# EAGLE design damp (EAGLE 7.1.0)
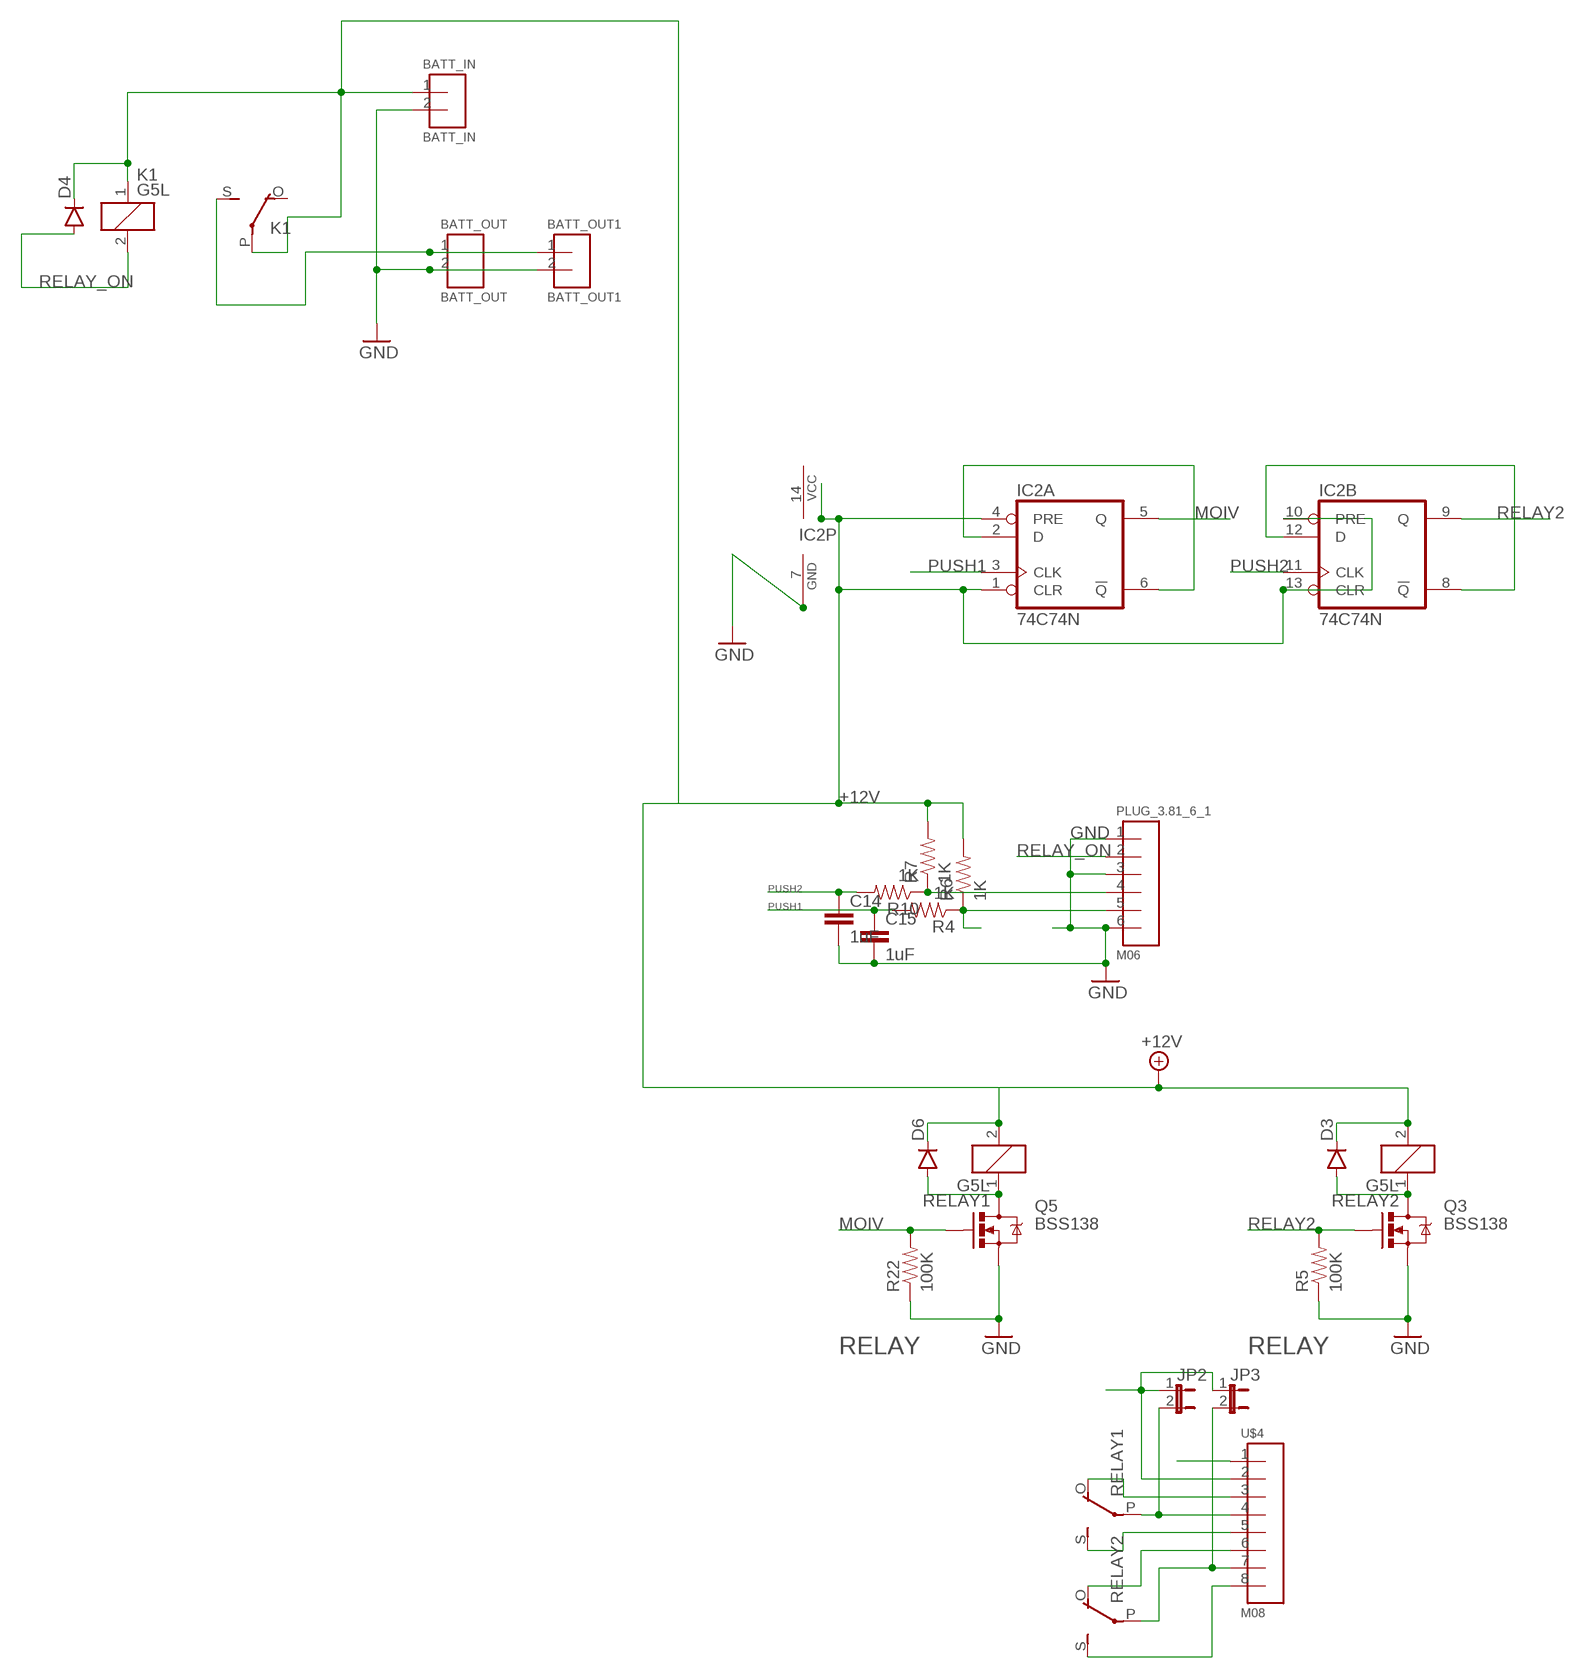
[diagram p0: schematic, sheet 1]

## Parts
BATT_IN  BATT_IN  M02PLUG  [PLUG_02]
BATT_OUT  BATT_OUT  M02PLUG  [PLUG_02]
BATT_OUT1  BATT_OUT1  M02PLUG  [PLUG_02]
C14  1uF  C-EUC0603  [C0603]
C15  1uF  C-EUC0603  [C0603]
D3  DIODESMA-ALT  [SMA-DIODE_ALT]
D4  DIODESMA-ALT  [SMA-DIODE_ALT]
D6  DIODESMA-ALT  [SMA-DIODE_ALT]
IC2  74C74N  74LS74N  [DIL14]
JP2  JP1E  [JP1]
JP3  JP1E  [JP1]
K1  G5L  [G5LE]
PLUG_3.81_6_1  M06  [PLUG_06]
Q3  BSS138  MOSFET-NCHANNELBSS138  [SOT23-3]
Q5  BSS138  MOSFET-NCHANNELBSS138  [SOT23-3]
R4  1K  RESISTOR0603-RES  [0603-RES]
R5  100K  RESISTOR0603-RES  [0603-RES]
R6  1K  RESISTOR0603-RES  [0603-RES]
R7  1K  RESISTOR0603-RES  [0603-RES]
R10  1K  RESISTOR0603-RES  [0603-RES]
R22  100K  RESISTOR0603-RES  [0603-RES]
RELAY1  G5L  [G5LE]
RELAY2  G5L  [G5LE]
U$4  M08  [PLUG_08]

## Nets
+12V [5V]: BATT_IN.1 D3.C D4.C D6.C IC2.1(A:CLR) IC2.4(A:PRE) IC2.10(B:PRE) IC2.13(B:CLR) K1.1 K1.P(2:P) R6.2 R7.2 RELAY1.2 RELAY2.2
AUDIO_OUT1: JP2.1 JP3.1 U$4.2
AUDIO_OUT2: U$4.1
GND: BATT_IN.2 BATT_OUT1.2 BATT_OUT.2 C14.2 C15.2 PLUG_3.81_6_1.1 PLUG_3.81_6_1.3 PLUG_3.81_6_1.6 Q3.2(S) Q5.2(S) R5.1 R22.1
MOIV: IC2.5(A:Q) Q5.1(G) R22.2
N$3: JP2.2 RELAY1.P(2:P) U$4.4
N$12: RELAY1.O(2:O) U$4.3
N$15: RELAY1.S(2:S) U$4.5
N$16: RELAY2.O(2:O) U$4.6
N$17: RELAY2.S(2:S) U$4.8
N$19: D6.A Q5.3(D) RELAY1.1
N$20: PLUG_3.81_6_1.4 R7.1 R10.1
N$21: JP3.2 RELAY2.P(2:P) U$4.7
N$22: PLUG_3.81_6_1.5 R4.1 R6.1
N$26: D3.A Q3.3(D) RELAY2.1
N$29: IC2.2(A:D) IC2.6(A:!Q)
N$32: IC2.8(B:!Q) IC2.12(B:D)
N$37 [5V]: BATT_OUT1.1 BATT_OUT.1 K1.S(2:S)
PUSH1: C15.1 IC2.3(A:CLK) R4.2
PUSH2: C14.1 IC2.11(B:CLK) R10.2
RELAY2: IC2.9(B:Q) Q3.1(G) R5.2
RELAY_ON: D4.A K1.2 PLUG_3.81_6_1.2
Unconnected: K1.O(2:O)

## Notes on the sheet
- RELAY | RELAY

## Power pins joined to a net without a drawn wire
GND: IC2.7(P:GND)
VCC: IC2.14(P:VCC)

## Library data of the parts
BATT_IN BATT_OUT BATT_OUT1 = pierre_vv:M02
C14 C15 = rcl:C-EU: CAPACITOR, European symbol
D3 D4 D6 = SparkFun-DiscreteSemi:DIODE: Diode These are standard reverse protection diodes and small signal diodes. SMA package can handle up to about 1A. SOD-323 can handle about 200mA. What the SOD-323 package when ordering, there are some mfgs out there that are 5-pin packages.
IC2 = 74xx-us:74*74: Dual D type positive edge triggered FLIP FLOP, preset and clear
JP2 JP3 = jumper:JP1E: JUMPER
K1 RELAY1 RELAY2 = relay:G5L: RELAY 1 x switch, 10 A/120 V AC, 8 A/30 V ADC, Omron; OC_FARNELL: unknown; OC_NEWARK: unknown
PLUG_3.81_6_1 = pierre_vv:M06
Q3 Q5 = SparkFun-DiscreteSemi:MOSFET-NCHANNEL: Common NMOSFET Parts MFG P/N Store ID Prod ID FDD8780 TRANS-09984 SI7820DN TRANS-11055 FDS6630A IC-08089 2N7002PW TRANS-11151 FQP30N06L COM-10213 TRANS-10060 BSS123LT1G TRANS-08345 BSS138 TRANS-00830 BS170 2N7000; PROD_ID: TRANS-00830
R4-R7 R10 R22 = SparkFun-Passives:RESISTOR: Resistor Basic schematic elements and footprints for 0603, 1206, and PTH resistors.
U$4 = pierre_vv:M08

## Net classes
0 default: width 0.203 mm
1 GND: width 0.254 mm
3 5V: width 0.305 mm
4 230AC: width 0.61 mm, clearance 0.305 mm

## Board
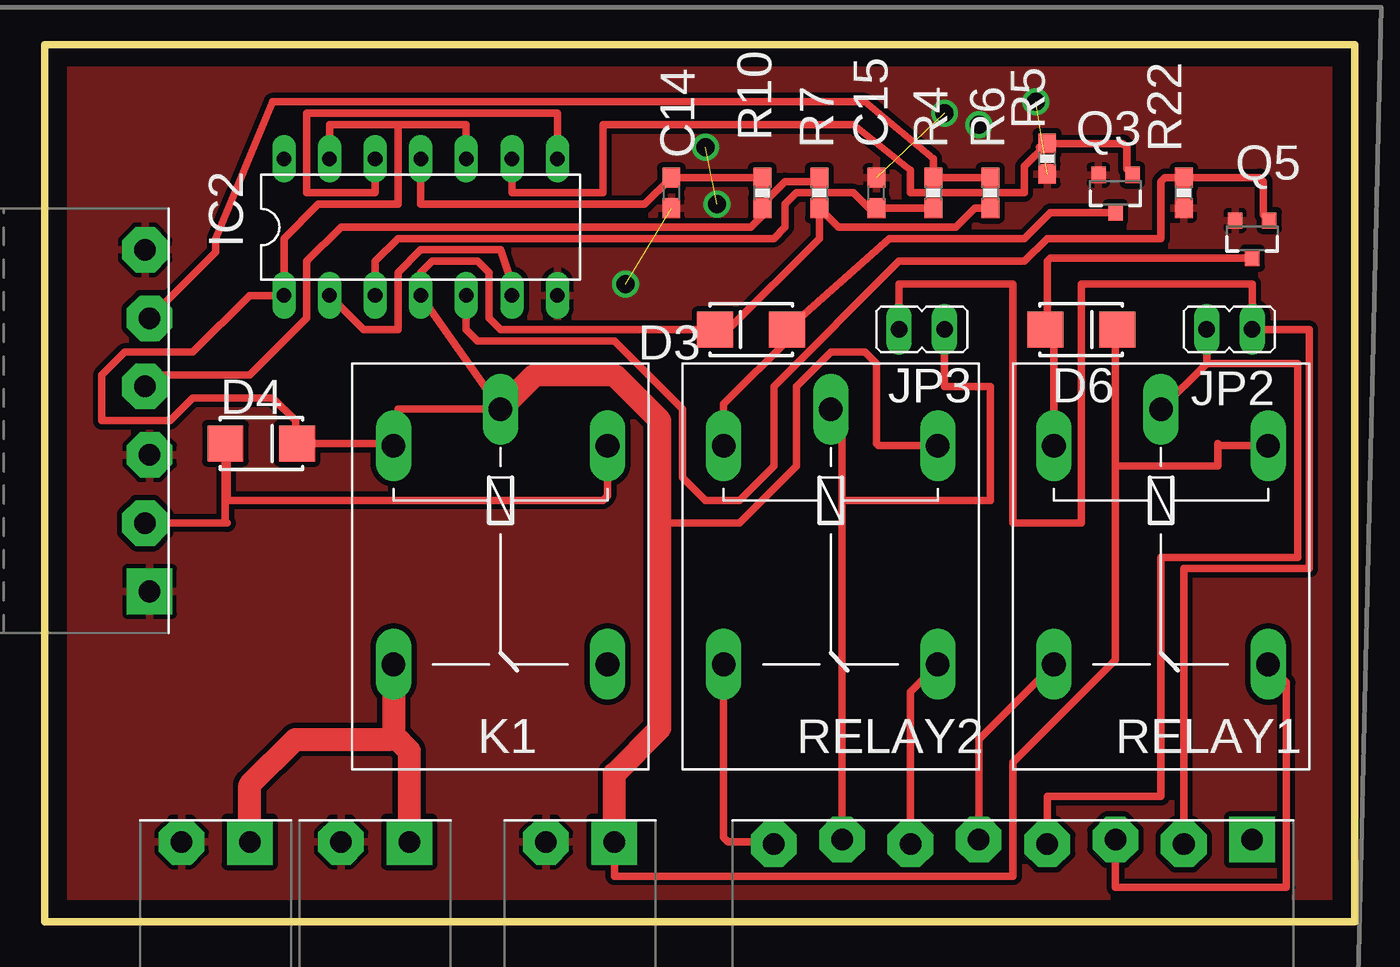
[diagram p1: board, top side]
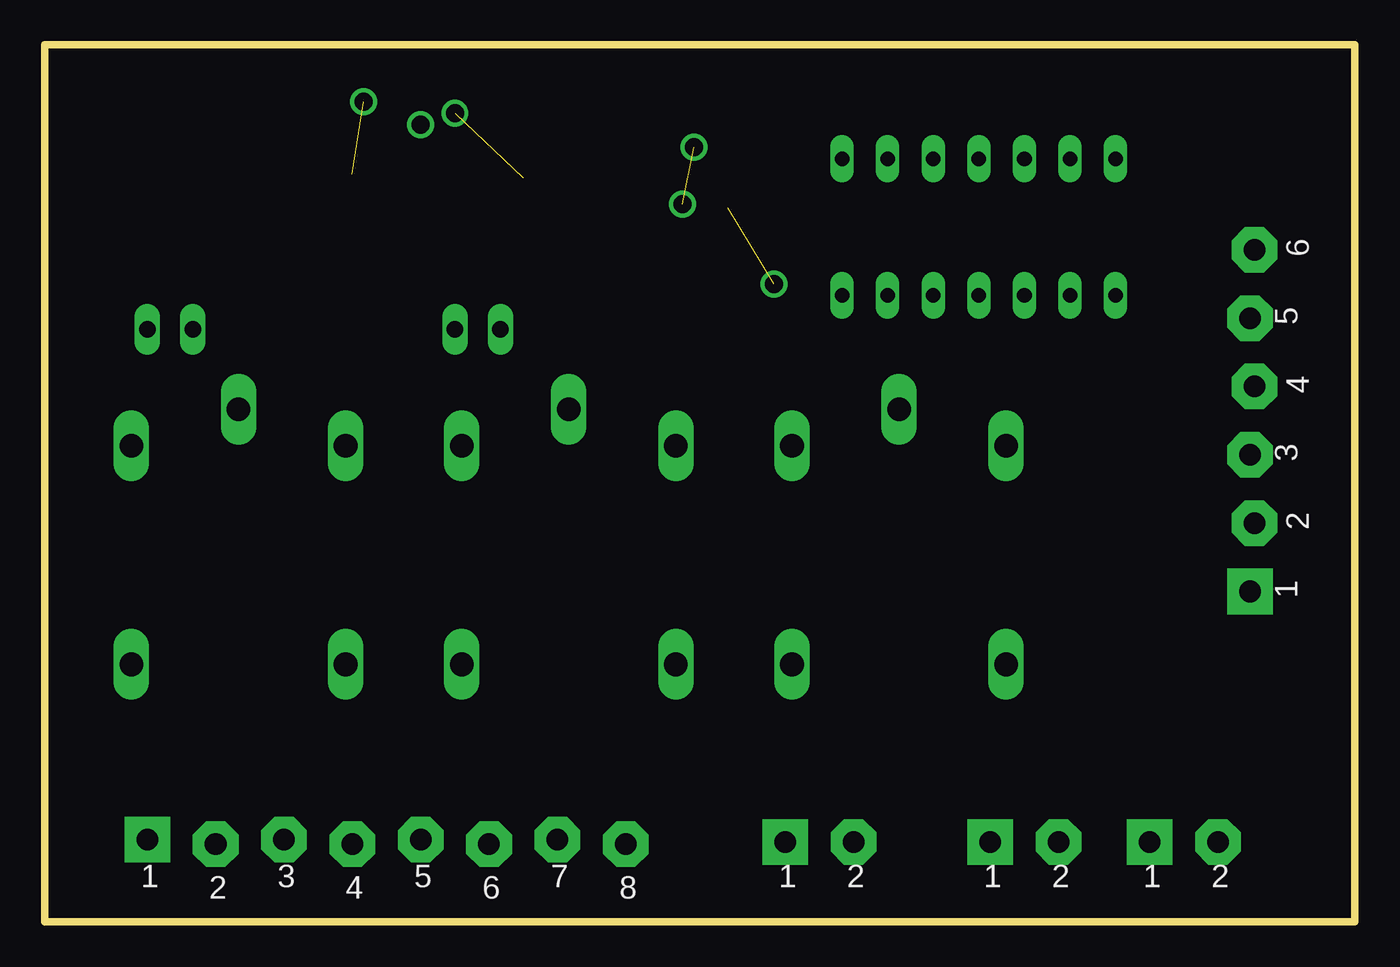
[diagram p2: board, bottom side, seen from below]

Size 73.03 x 48.9 mm. Coordinates in mm from the lower left corner, seen from the top.
Outline: 0,0 73.03,0 73.03,48.9 0,48.9 0,0
Copper layers (1*16): Top 0.035mm / dielectric 1.5mm / Bottom 0.035mm
Design rules "default": minimum track width 10mil, minimum drill 24mil, track to track 8mil, track to pad 8mil, pad to pad 8mil, via to via 8mil, smd to smd 8mil, copper to edge 40mil, drill to drill 8mil, minimum pad ring 10mil, minimum via ring 8mil, stop-mask expansion 4mil, vias tented up to drill 0mil, thermal gap 10mil

### Footprints (pad centres in the part's own frame; a part is rotated, then mirrored left to right if it is on the bottom)
PLUG_02 = drill 1.2 pad 2.54 square: 1 -1.905,0 | drill 1.2 pad 2.54 octagon: 2 1.905,0
C0603 = smd 1.1 x 1: 1 -0.85,0; 2 0.85,0
SMA-DIODE_ALT = smd 2 x 2: A -2,0; C 2,0
DIL14 = drill 0.813 long: 1 -7.62,-3.81; 2 -5.08,-3.81; 3 -2.54,-3.81; 4 0,-3.81; 5 2.54,-3.81; 6 5.08,-3.81; 7 7.62,-3.81; 8 7.62,3.81; 9 5.08,3.81; 10 2.54,3.81; 11 0,3.81; 12 -2.54,3.81; 13 -5.08,3.81; 14 -7.62,3.81
JP1 = drill 0.914 long: 1 0,-1.27; 2 0,1.27
G5LE = drill 1.321 long: 1 -7.493,-5.969; 2 -7.493,5.969; O 4.699,5.969; P -9.525,0; S 4.699,-5.969
PLUG_06 = drill 1.2 pad 2.54 square: 1 -9.525,-0.127 | drill 1.2 pad 2.54 octagon: 2 -5.715,0.127; 3 -1.905,-0.127; 4 1.905,0.127; 5 5.715,-0.127; 6 9.525,0.127
SOT23-3 = smd 0.8 x 0.9: 1 -0.95,-1; 2 0.95,-1; 3 0,1.1
0603-RES = smd 1.1 x 1: 1 -0.85,0; 2 0.85,0
PLUG_08 = drill 1.2 pad 2.54 square: 1 -13.335,-0.127 | drill 1.2 pad 2.54 octagon: 2 -9.525,0.127; 3 -5.715,-0.127; 4 -1.905,0.127; 5 1.905,-0.127; 6 5.715,0.127; 7 9.525,-0.127; 8 13.335,0.127

### Placement (x,y rotation side)
BATT_IN  29.84,4.45 180 top
BATT_OUT  9.53,4.45 180 top
BATT_OUT1  18.41,4.45 180 top
C14  34.92,40.64 270 top
C15  46.35,40.64 90 top
D3  39.37,33.02 180 top
D4  12.06,26.67 0 top
D6  57.78,33.02 0 top
IC2  20.95,38.73 0 top
JP2  66.04,33.02 90 top
JP3  48.9,33.02 270 top
K1  25.4,19.05 270 top
PLUG_3.81_6_1  5.71,27.94 90 top
Q3  59.69,40.64 180 top
Q5  67.31,38.1 180 top
R4  49.53,40.64 270 top
R5  55.88,42.55 90 top
R6  52.7,40.64 270 top
R7  43.18,40.64 270 top
R10  40.01,40.64 90 top
R22  63.5,40.64 90 top
RELAY1  62.23,19.05 270 top
RELAY2  43.81,19.05 270 top
U$4  53.98,4.45 180 top

### Tracks (layer width: path | path; a pad name or v marks a point on that pad's centre or on a via)
+12V
  Top 0.406: IC2.13 15.88,44.45 19.68,44.45 | 19.68,44.45 23.5,44.45 IC2.10 | 19.68,44.45 19.68,40.01 15.24,40.01 13.34,38.1 IC2.1 11.43,34.92 8.26,31.75 4.45,31.75 3.17,30.48 3.17,27.94 6.99,27.94 8.26,29.21 12.7,29.21 13.97,27.94 13.97,26.77 D4.C 19.3,26.67 K1.1 19.68,26.8 19.68,28.57 K1.P IC2.4 20.95,36.2 21.59,36.83 24.13,36.83 24.77,36.2 24.77,33.66 25.4,33.02 D3.C 38.1,33.02 43.18,38.1 R7.2 44.23,38.73 50.8,38.73 51.85,39.79 R6.2 | RELAY1.2 65.53,26.54 65.41,26.67 65.41,25.4 59.69,25.4 | 59.69,25.4 59.69,32.38 | 59.69,32.38 59.69,32.92 D6.C 59.78,32.48 59.69,32.38 | RELAY2.2 46.48,26.54 46.35,26.67 46.35,31.11 45.72,31.75 43.81,31.75 41.91,29.84 41.91,25.4 38.73,22.23 34.29,22.23 | 59.69,25.4 59.69,14.61 53.98,8.89 53.98,2.54 31.75,2.54 BATT_IN.1
  Top 1.27: BATT_IN.1 31.75,8.26 34.29,10.79 34.29,22.23 34.29,27.94 31.75,30.48 27.3,30.48 K1.P
AUDIO_OUT1
  Top 0.406: U$4.2 63.5,19.68 70.48,19.68 70.48,33.02 JP2.1 67.31,35.56 57.78,35.56 57.78,22.23 53.98,22.23 53.98,35.56 47.62,35.56 JP3.1
GND  (via drill 1)  (4 unrouted)
  other vias: 37.47,40.01 32.38,35.56 36.83,43.18 50.16,45.09 52.07,44.45 55.24,45.72 55.24,45.72
  pour Top (isolate 0.305): -1.91,53.34 76.2,53.34 77.47,-0.64 -0.64,-0.64
MOIV
  Top 0.406: Q5.1 67.94,39.41 67.94,41.27 67.73,41.49 R22.2 62.45,41.49 62.23,41.27 62.23,38.1 55.88,38.1 54.61,36.83 47.62,36.83 40.64,29.84 40.64,25.4 38.73,23.5 36.83,23.5 35.56,24.77 35.56,28.57 31.75,32.38 24.13,32.38 23.5,33.02 IC2.5
N$3
  Top 0.406: U$4.4 55.88,6.99 62.23,6.99 62.23,20.32 69.85,20.32 69.85,31.11 64.77,31.11 | 64.77,31.11 JP2.2 | 64.77,31.11 RELAY1.P
N$12
  Top 0.406: U$4.3 59.69,1.91 69.22,1.91 69.22,13.34 RELAY1.O
N$15
  Top 0.406: U$4.5 52.07,10.16 RELAY1.S
N$16
  Top 0.406: U$4.6 48.26,12.83 RELAY2.O
N$17
  Top 0.406: RELAY2.S 37.85,4.7 38.1,4.45 40.51,4.45 U$4.8
N$19
  Top 0.406: RELAY1.1 56.26,32.54 D6.A 55.88,33.12 55.88,36.83 56.05,37 Q5.3
N$20
  Top 0.406: R7.1 42.97,41.27 41.27,41.27 40.01,40.01 R10.1 40.01,39.37 39.37,38.73 16.51,38.73 14.61,36.83 14.61,33.66 11.43,30.48 6.22,30.48 PLUG_3.81_6_1.4
N$21
  Top 0.406: U$4.7 44.45,23.5 | 44.45,23.5 44.45,27.94 RELAY2.P | JP3.2 50.16,29.84 52.7,29.84 52.7,23.5 44.45,23.5
N$22
  Top 0.406: R6.1 R4.1 49.53,42.55 45.72,45.72 12.7,45.72 9.53,38.1 9.53,37.34 PLUG_3.81_6_1.5
N$26
  Top 0.406: RELAY2.1 37.85,28.86 41.64,32.66 D3.A 47.09,38.1 54.61,38.1 56.05,39.54 Q3.3
N$29
  Top 0.406: IC2.2 17.78,33.02 19.68,33.02 19.68,36.2 20.95,37.47 25.4,37.47 26.04,35.56 IC2.6
N$32
  Top 0.406: IC2.8 28.57,45.09 14.61,45.09 14.61,40.64 18.41,40.64 IC2.12
N$37
  Top 1.27: K1.S 19.43,10.41 | 19.43,10.41 20.32,9.53 BATT_OUT1.1 | BATT_OUT.1 11.43,7.62 13.97,10.16 19.18,10.16 19.43,10.41
PUSH1
  Top 0.406: R4.2 C15.1 45.94,39.79 45.09,40.64 41.91,40.64 41.27,40.01 41.27,38.73 40.64,38.1 19.68,38.1 18.41,36.83 IC2.3
PUSH2
  Top 0.406: IC2.11 20.95,40.01 33.44,40.01 C14.1 R10.2
RELAY2
  Top 0.406: IC2.9 26.04,40.64 31.11,40.64 31.11,44.45 45.09,44.45 48.26,41.91 48.26,40.64 54.61,40.64 54.61,42.12 R5.2 | 55.46,43.18 R5.2 | R5.2 60.11,43.4 60.33,43.18 60.33,41.95 Q3.1
RELAY_ON
  Top 0.406: K1.2 31.37,23.75 31.11,23.5 10.16,23.5 10.16,26.57 D4.A 10.06,22.32 10.16,22.23 PLUG_3.81_6_1.2